# Altium schematic sheet 01rng.SchDoc
size A
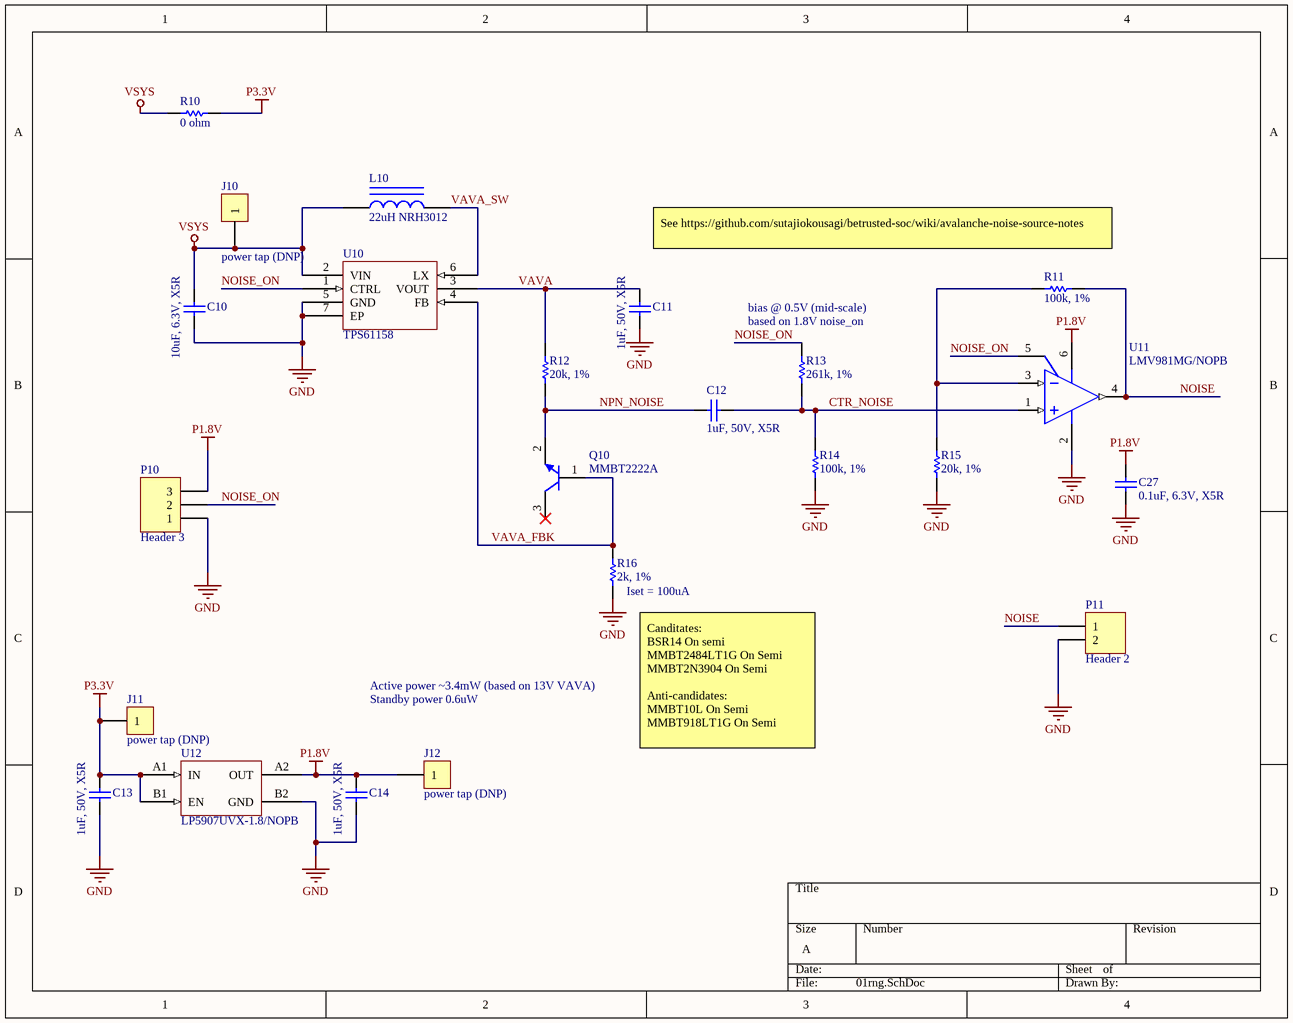
[diagram p0: 01rng.SchDoc]

## Parts
C10  10uF, 6.3V, X5R  [B_CAP0603]
C11  1uF, 50V, X5R  [B_CAP0603]
C12  1uF, 50V, X5R  [B_CAP0603]
C13  1uF, 50V, X5R  [B_CAP0603]
C14  1uF, 50V, X5R  [B_CAP0603]
C27  0.1uF, 6.3V, X5R  [B_CAP0603]
J10  power tap (DNP)  [RESTAP-0603]
J11  power tap (DNP)  [RESTAP-0603]
J12  power tap (DNP)  [RESTAP-0603]
L10  22uH NRH3012  [TAIYO_NRH3012]
P10  Header 3  [HDR1X3]
P11  Header 2  [HDR1X2]
Q10  MMBT2222A  [ONSC-SOT-23-3-318-08_V]
R10  0 ohm  [B_RES0603]
R11  100k, 1%  [B_RES0402]
R12  20k, 1%  [B_RES0402]
R13  261k, 1%  [B_RES0402]
R14  100k, 1%  [B_RES0402]
R15  20k, 1%  [B_RES0402]
R16  2k, 1%  [B_RES0402]
U10  TPS61158  [SON65P200X80_HS-7N]
U11  LMV981MG/NOPB  [DCK0006A_N]
U12  LP5907UVX-1.8/NOPB  [TI_YKE004]

## Nets
GND: C10.2 C11.2 C13.2 C14.2 C27.1 P10.1 P11.2 R14.1 R15.1 R16.1 U10.5(GND) U10.7(EP) U11.2(GND) U12.B2(GND)
P1.8V: C14.1 C27.2 J12.1 P10.3 U11.6(VDD) U12.A2(OUT)
P3.3V: C13.1 J11.1 R10.2 U12.A1(IN) U12.B1(EN)
VSYS: C10.1 J10.1 L10.1 R10.1 U10.2(VIN)
CTR_NOISE: C12.2 R13.1 R14.2 U11.1(IN+)
NOISE: P11.1 R11.1 U11.4(OUT)
NOISE_ON: P10.2 R13.2 U10.1(CTRL) U11.5(~{SHDN})
NPN_NOISE: C12.1 Q10.2(E) R12.1
VAVA: C11.1 R12.2 U10.3(VOUT)
VAVA_FBK: Q10.1(B) R16.2 U10.4(FB)
VAVA_SW: L10.2 U10.6(LX)
NetR11_2: R11.2 R15.2 U11.3(IN-)

Not connected (* = marked no-connect by the designer): Q10 3(C)*

## Notes on the sheet
- See https://github.com/sutajiokousagi/betrusted-soc/wiki/avalanche-noise-source-notes
- (near R13) bias @ 0.5V (mid-scale)
- (near R13) based on 1.8V noise_on
- (near R16) Iset = 100uA
- Active power ~3.4mW (based on 13V VAVA)
- Standby power 0.6uW
- (near R16) Canditates:
  BSR14 On semi
  MMBT2484LT1G On Semi
  MMBT2N3904 On Semi
  Anti-candidates:
  MMBT10L On Semi
  MMBT918LT1G On Semi

## Library data of the parts
C10 = Cap Semi: Capacitor (Semiconductor SIM Model); MPN: CL10A106MQ8NNNC; VENDOR: Samsung; MYPN: C-106-6.3-X5R-0603
C11-C14 = Cap Semi: Capacitor (Semiconductor SIM Model); MPN: CL10A105KB8NNNC; VENDOR: Samsung; MYPN: C-105-50-X5R-0603
C27 = Cap Semi: Capacitor (Semiconductor SIM Model); MPN: ANY; MYPN: C-104-6.3-X5R-0603; VENDOR: ANY
J10-J12 = CON1: Connector; MYPN: J-TP-PWRTAP-0603; MPN: DNP; VENDOR: DNP
L10 = Inductor Iron: Magnetic-Core Inductor; MPN: NRH3012T220MN; VENDOR: Taiyo Yuden; MYPN: L-NRH3012T220MN
P10 = Header 3: Header, 3-Pin; LatestRevisionDate: 17-Jul-2002; LatestRevisionNote: Re-released for DXP Platform.; Publisher: Altium Limited
P11 = Header 2: Header, 2-Pin; LatestRevisionDate: 17-Jul-2002; LatestRevisionNote: Re-released for DXP Platform.; Publisher: Altium Limited
Q10 = ONSC-NPN-B1E2C3-3: VENDOR: Diodes Inc; MYPN: Q-NPN-BCE-SOT23; MPN: MMBT2222A
R10 = Res1: Resistor; VENDOR: ANY; MYPN: R-0R0-1P-1_16W-0603; MPN: ANY
R11 R14 = Res1: Resistor; VENDOR: ANY; MYPN: R-104-1P-1_16W-0402; MPN: ANY
R12 R15 = Res1: Resistor; VENDOR: ANY; MYPN: R-203-1P-1_16W-0402; MPN: ANY
R13 = Res1: Resistor; VENDOR: ANY; MYPN: R-264-1P-1_16W-0402; MPN: ANY
R16 = Res1: Resistor; VENDOR: ANY; MYPN: R-202-1P-1_16W-0402; MPN: ANY
U10 = TPS61158: 30V WLED driver with integrated power diode; MPN: TPS61158DRVR; VENDOR: TI; MYPN: U-TPS61158DRVR
U11 = CMP-0055-01099-3: Single 1.8V, RRIO Operational Amplifiers with Shutdown, 6-pin SC-70, Pb-Free; PowerWise: N; PackageTopMarking: A77*XTT; VENDOR: Texas Instruments; ComponentLink1URL: http://www.ti.com/general/docs/lit/getliterature.tsp?genericPartNumber=LMV981-N&fileType=pdf; PackageDescription: Molded SC-70, 2 x 1.25 x .9mm, 6 Lead, 0.65mm Pitch; RoHS: Y; PinCount: 6; ComponentLink1Description: Datasheet URL; CompType: Amplifiers; Package Reference: DCK0006A; MPN: LMV981MG/NOPB
U12 = LP5907UVX: Ultra low-noise 250mA LDO for RF and analog in DSBGA; VENDOR: TI; MYPN: ULP5907UVX-1.8; MPN: LP5907UVX-1.8/NOPB